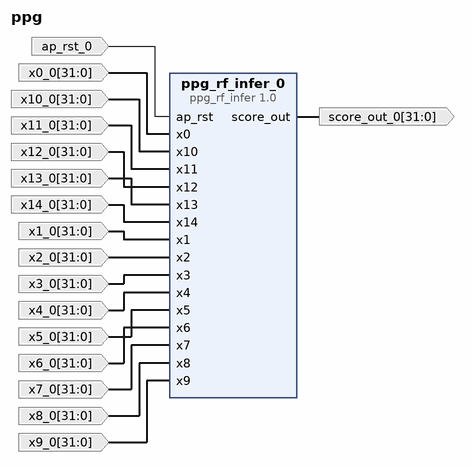
[diagram p0: block diagram of the top level]
# Vivado block design ppg, xc7a100tcsg324-1, Vivado 2024.1
create_bd_design ppg

create_bd_port -dir I -type rst ap_rst_0
set_property -dict {CONFIG.POLARITY ACTIVE_HIGH} [get_bd_ports ap_rst_0]
create_bd_port -dir O -from 31 -to 0 -type data score_out_0
create_bd_port -dir I -from 31 -to 0 -type data x0_0
create_bd_port -dir I -from 31 -to 0 -type data x1_0
create_bd_port -dir I -from 31 -to 0 -type data x10_0
create_bd_port -dir I -from 31 -to 0 -type data x11_0
create_bd_port -dir I -from 31 -to 0 -type data x12_0
create_bd_port -dir I -from 31 -to 0 -type data x13_0
create_bd_port -dir I -from 31 -to 0 -type data x14_0
create_bd_port -dir I -from 31 -to 0 -type data x2_0
create_bd_port -dir I -from 31 -to 0 -type data x3_0
create_bd_port -dir I -from 31 -to 0 -type data x4_0
create_bd_port -dir I -from 31 -to 0 -type data x5_0
create_bd_port -dir I -from 31 -to 0 -type data x6_0
create_bd_port -dir I -from 31 -to 0 -type data x7_0
create_bd_port -dir I -from 31 -to 0 -type data x8_0
create_bd_port -dir I -from 31 -to 0 -type data x9_0

create_bd_cell -type ip -vlnv xilinx.com:hls:ppg_rf_infer:1.0 ppg_rf_infer_0

# ---- connections ----

connect_bd_net -net ap_rst_0_1 [get_bd_ports ap_rst_0] [get_bd_pins ppg_rf_infer_0/ap_rst]
connect_bd_net [get_bd_pins ppg_rf_infer_0/score_out] [get_bd_ports score_out_0]
connect_bd_net -net x0_0_1 [get_bd_ports x0_0] [get_bd_pins ppg_rf_infer_0/x0]
connect_bd_net -net x10_0_1 [get_bd_ports x10_0] [get_bd_pins ppg_rf_infer_0/x10]
connect_bd_net -net x11_0_1 [get_bd_ports x11_0] [get_bd_pins ppg_rf_infer_0/x11]
connect_bd_net -net x12_0_1 [get_bd_ports x12_0] [get_bd_pins ppg_rf_infer_0/x12]
connect_bd_net -net x13_0_1 [get_bd_ports x13_0] [get_bd_pins ppg_rf_infer_0/x13]
connect_bd_net -net x14_0_1 [get_bd_ports x14_0] [get_bd_pins ppg_rf_infer_0/x14]
connect_bd_net -net x1_0_1 [get_bd_ports x1_0] [get_bd_pins ppg_rf_infer_0/x1]
connect_bd_net -net x2_0_1 [get_bd_ports x2_0] [get_bd_pins ppg_rf_infer_0/x2]
connect_bd_net -net x3_0_1 [get_bd_ports x3_0] [get_bd_pins ppg_rf_infer_0/x3]
connect_bd_net -net x4_0_1 [get_bd_ports x4_0] [get_bd_pins ppg_rf_infer_0/x4]
connect_bd_net -net x5_0_1 [get_bd_ports x5_0] [get_bd_pins ppg_rf_infer_0/x5]
connect_bd_net -net x6_0_1 [get_bd_ports x6_0] [get_bd_pins ppg_rf_infer_0/x6]
connect_bd_net -net x7_0_1 [get_bd_ports x7_0] [get_bd_pins ppg_rf_infer_0/x7]
connect_bd_net -net x8_0_1 [get_bd_ports x8_0] [get_bd_pins ppg_rf_infer_0/x8]
connect_bd_net -net x9_0_1 [get_bd_ports x9_0] [get_bd_pins ppg_rf_infer_0/x9]

validate_bd_design
save_bd_design
